# Altium schematic sheet LCD_SD.SchDoc
size A3; Address1: Address1; Address2: Address2; Address3: Address3; Address4: Address4
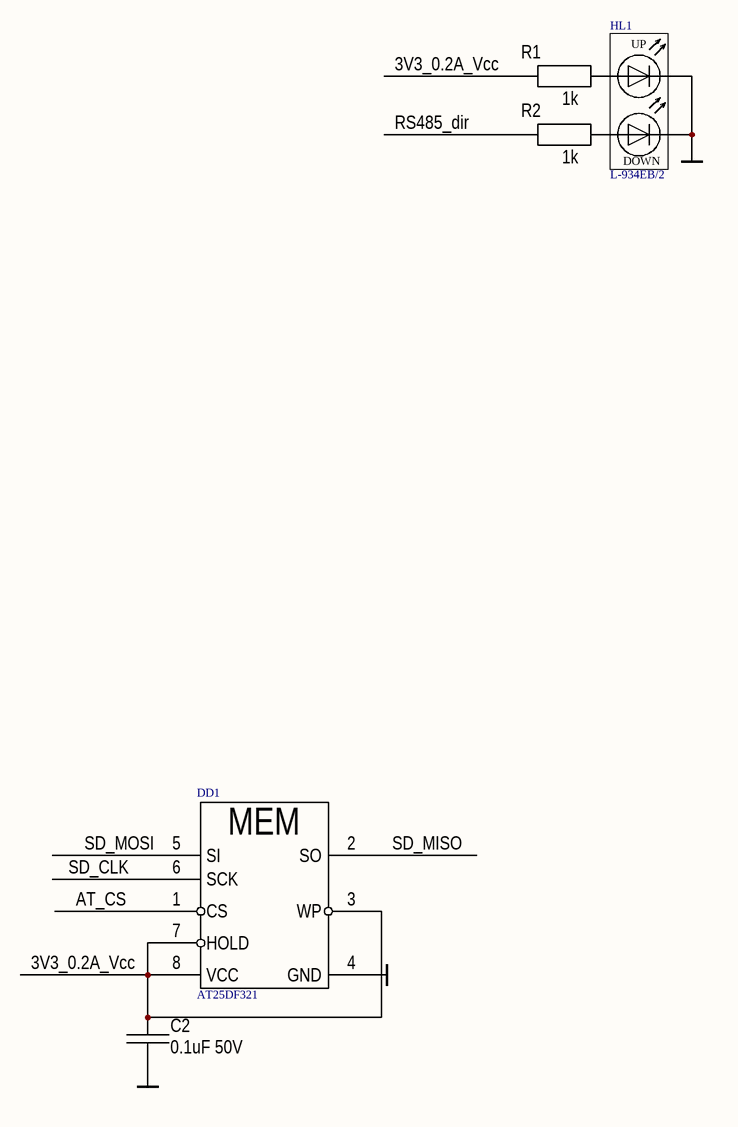
[diagram p0: LCD_SD.SchDoc]

## Parts
C2  0.1uF 50V  [0805_CAP]
DD1  AT25DF321  [soic8-200]
HL1  L-934EB/2  [L-934EB/2]
R1  1k  [0805_RES]
R2  1k  [0805_RES]

## Nets
GND: C2.2 DD1.4(GND) HL1.1 HL1.3
3V3_0.2A_Vcc: C2.1 DD1.3(WP) DD1.7(HOLD) DD1.8(VCC) R1.2
AT_CS: DD1.1(CS)
RS485_dir: R2.2
SD_CLK: DD1.6(SCK)
SD_MISO: DD1.2(SO)
SD_MOSI: DD1.5(SI)
NetHL1_2: HL1.2 R2.1
NetHL1_4: HL1.4 R1.1

## Notes on the sheet
- Title
- Size:
- Date:
- A3
- Number:
- Time:
- Revision:
- Sheet
- of
- File:
- (in symbol AT25DF321) MEM
- (in symbol LEDx2) UP; DOWN

## Library data of the parts
C2 = Cap_np: Value: 0.1uF 50V
HL1 = LEDx2: Value: L-934EB/2
R1 R2 = Res: Value: 1k
DD1 = AT25DF321: Value: AT25DF321